# EAGLE design JTAG_Programmer (EAGLE 9.5.2)
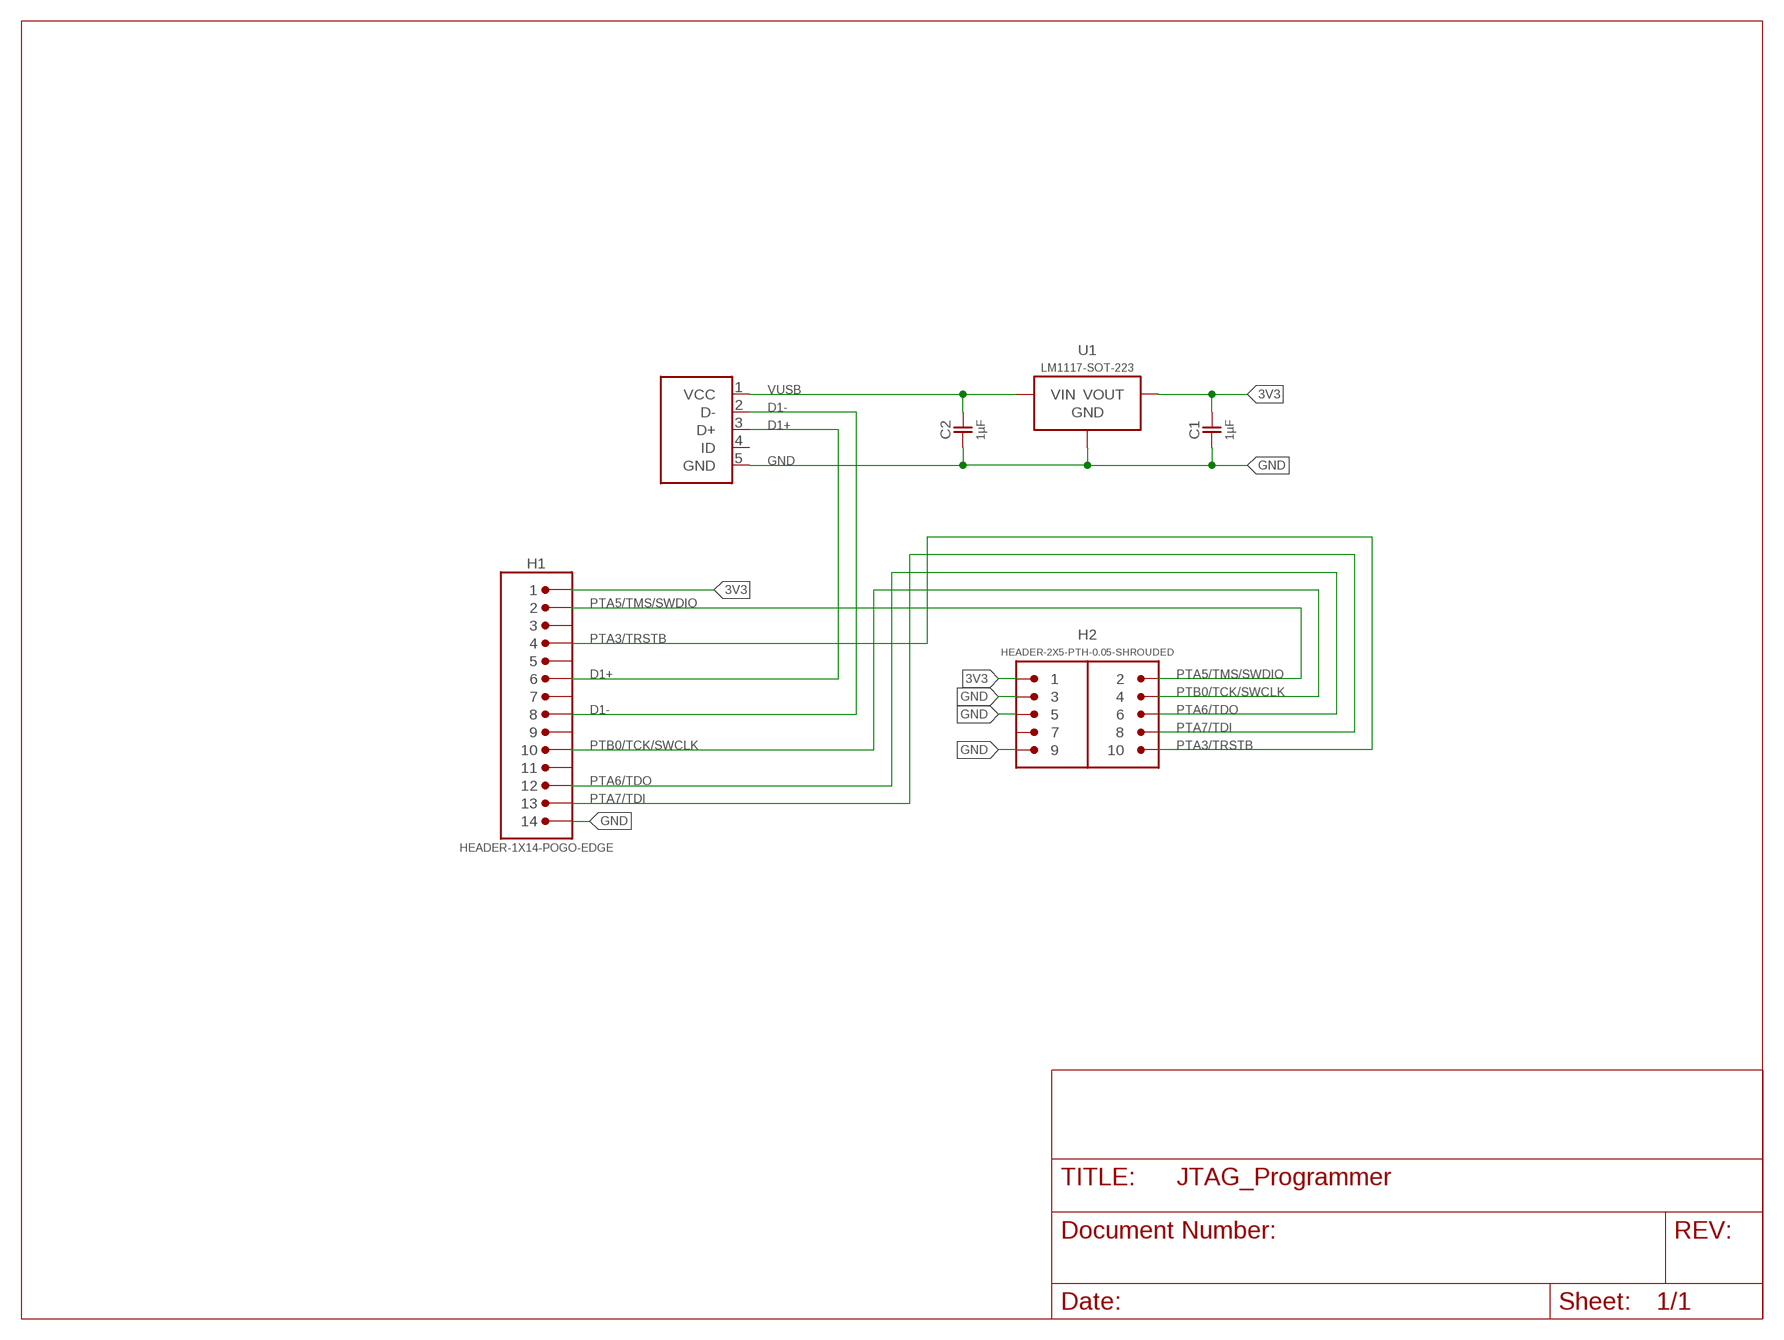
[diagram p0: schematic, sheet 1]

## Parts
C1  1µF  CAP-NP-0805  [0805-NP]
C2  1µF  CAP-NP-0805  [0805-NP]
H1  HEADER-1X14-POGO-EDGE  [2X7-1.27MM-POGO-EDGE]
H2  HEADER-2X5-PTH-0.05-SHROUDED  [PTH-0.05-2X5-SHROUDED]
J1  USB-5-MICRO-B  [USB-MICRO-B]
U1  LM1117-SOT-223  [SOT-223]

## Nets
3V3: C1.2 H1.1 H2.1 U1.2(VOUT) U1.4(VOUT)
D1+: H1.6 J1.3(D+)
D1-: H1.8 J1.2(D-)
GND: C1.1 C2.1 H1.14 H2.3 H2.5 H2.9 J1.5(GND) U1.1(GND)
PTA3/TRSTB: H1.4 H2.10
PTA5/TMS/SWDIO: H1.2 H2.2
PTA6/TDO: H1.12 H2.6
PTA7/TDI: H1.13 H2.8
PTB0/TCK/SWCLK: H1.10 H2.4
VUSB: C2.2 J1.1(VCC) U1.3(VIN)
Unconnected: H1.3 H1.5 H1.7 H1.9 H1.11 H2.7 J1.4(ID)

## Library data of the parts
C1 C2 = T2M_4_0:CAP-NP
H1 = T2M_4_0:HEADER-1X14
H2 = T2M_4_0:HEADER-2X5
J1 = T2M_4_0:USB-5
U1 = T2M_4_0:LM1117: 800mA and 1A Low Dropout (LDO) Positive Regulator 1.8V, 2.5V, 2.85V, 3.3V, 5V, and Adj

## Board
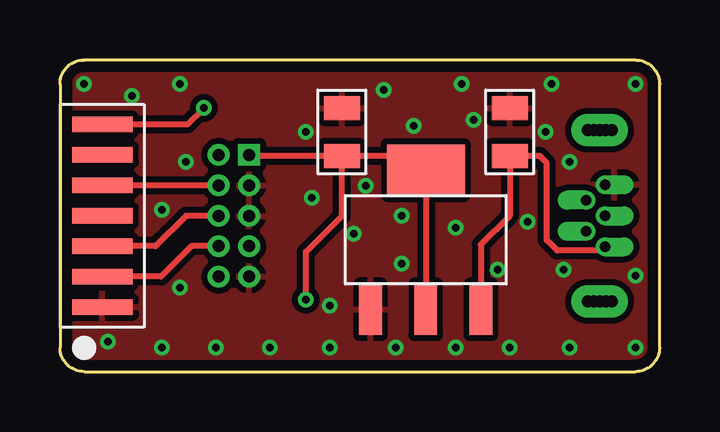
[diagram p1: board, top side]
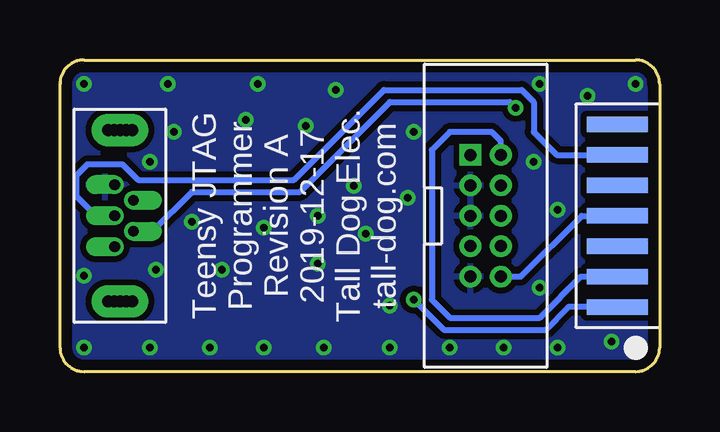
[diagram p2: board, bottom side, seen from below]

Size 25 x 13 mm. Coordinates in mm from the lower left corner, seen from the top.
Outline: 1,0 24,0 arc90 25,1 25,12 arc90 24,13 1,13 arc90 0,12 0,1 arc90 1,0
Copper layers (1*16): Top 0.035mm / dielectric 1.5mm / Bottom 0.035mm
Design rules "default *": minimum track width 6mil, minimum drill 0.3mm, track to track 6mil, track to pad 6mil, pad to pad 6mil, via to via 6mil, smd to smd 6mil, copper to edge 17mil, drill to drill 6mil, minimum pad ring 7mil, minimum via ring 7mil, stop-mask expansion 0mil, vias tented up to drill 0.3mm, thermal gap 0.25mm

### Footprints (pad centres in the part's own frame; a part is rotated, then mirrored left to right if it is on the bottom)
0805-NP = smd 1 x 1.5: 1 -1,0; 2 1,0
2X7-1.27MM-POGO-EDGE = smd 0.635 x 2.54 bottom: 1 -3.81,-1.77; 2 -2.54,-1.77; 3 -1.27,-1.77; 4 0,-1.77; 5 1.27,-1.77; 6 2.54,-1.77; 7 3.81,-1.77 | smd 0.635 x 2.54: 8 3.81,-1.77; 9 2.54,-1.77; 10 1.27,-1.77; 11 0,-1.77; 12 -1.27,-1.77; 13 -2.54,-1.77; 14 -3.81,-1.77
PTH-0.05-2X5-SHROUDED = drill 0.5 pad 0.9 square: 1 -0.635,2.54 | drill 0.5 pad 0.9: 2 0.635,2.54; 3 -0.635,1.27; 4 0.635,1.27; 5 -0.635,0; 6 0.635,0; 7 -0.635,-1.27; 8 0.635,-1.27; 9 -0.635,-2.54; 10 0.635,-2.54
USB-MICRO-B = drill 0.44 pad 0.74 offset: 1 -1.3,0.22; 2 -0.65,-0.56; 3 0,0.22; 4 0.65,-0.56; 5 1.3,0.22 | drill 0.5 pad 1.35: G1A -3.575,0.5; G1B -3.575,0.25; G1C -3.575,0; G1D -3.575,-0.25; G1E -3.575,-0.5; G2A 3.575,0.5; G2B 3.575,0.25; G2C 3.575,0; G2D 3.575,-0.25; G2E 3.575,-0.5
SOT-223 = smd 0.95 x 2.15: 1 -2.3,-2.9; 2 0,-2.9; 3 2.3,-2.9 | smd 3.25 x 2.15: 4 0,2.9

### Placement (x,y rotation side)
C1  11.75,10 270 top
C2  18.75,10 270 top
H1  0,6.5 90 top
H2  7.25,6.5 0 bottom
J1  22.5,6.5 90 bottom
U1  15.25,5.5 0 top

### Tracks (layer width: path | path; a pad name or v marks a point on that pad's centre or on a via)
3V3  (via drill 0.3)
  Top 0.25: C1.2 7.92,9 H2.1 | v10.25,3 10.25,5 11.75,6.5 C1.2 | U1.2 U1.4 14.65,9 C1.2
  Bottom 0.25: H1.1 3.81,2.69 4.75,1.75 9,1.75 v10.25,3
D1+
  Bottom 0.25: J1.3 23.5,6.5 24.3,7.3 24.3,8.2 23.85,8.65 22.4,8.65 21.75,8 15.25,8 11.5,11.75 5.75,11.75 5.25,11.25 5.25,10 4.29,9.04 H1.6
D1-  (via drill 0.3)
  Top 0.25: v6,11 5.31,10.31 H1.8
  Bottom 0.25: J1.2 21.15,5.85 19.5,7.5 15,7.5 11.25,11.25 6.25,11.25 v6,11
GND  (via drill 0.3)
  other vias: 21.25,1 17.25,10.5 1,12 2,1.25 24,1 24,12 10.5,7.25 11.25,2.75 11.25,1 5,3.5 4.25,6.75 4.25,1 6.5,1 8.75,1 5.25,8.75 5,12 10.25,10 13.5,11.75 12.75,7.75 14.25,6.5 14.25,4.5 14,1 16.5,1 16.5,6 14.75,10.25 20.5,12 21.25,8.75 20.25,10 19.5,6.25 18.25,4.25 24,4 16.75,12 21,4.25 18.75,1 12.25,5.75 3,11.5
  pour Top (isolate 0.25): 0,13 25,13 25,0 0,0
  pour Bottom (isolate 0.25): 0,13 25,13 25,0 0,0
PTA3/TRSTB
  Bottom 0.25: H2.10 5.79,3.96 3.25,6.5 H1.4
PTA5/TMS/SWDIO
  Bottom 0.25: H2.2 6.62,9.62 7,10 8.75,10 9.5,9.25 9.5,3 8.75,2.25 5,2.25 3.29,3.96 H1.2
PTA6/TDO
  Top 0.25: H2.6 5.25,6.5 3.98,5.23 H1.12
PTA7/TDI
  Top 0.25: H2.8 5.48,5.23 4.21,3.96 H1.13
PTB0/TCK/SWCLK
  Top 0.25: H2.4 H1.10
VUSB
  Top 0.25: J1.1 22.57,5.05 20.74,5.05 20.3,5.49 20.3,8.7 20,9 C2.2 18.75,6.5 17.55,5.3 U1.3

### Text on the board
bPlace: Teensy JTAG / Programmer / Revision A / 2019-12-17 / Tall Dog Elec. / tall-dog.com